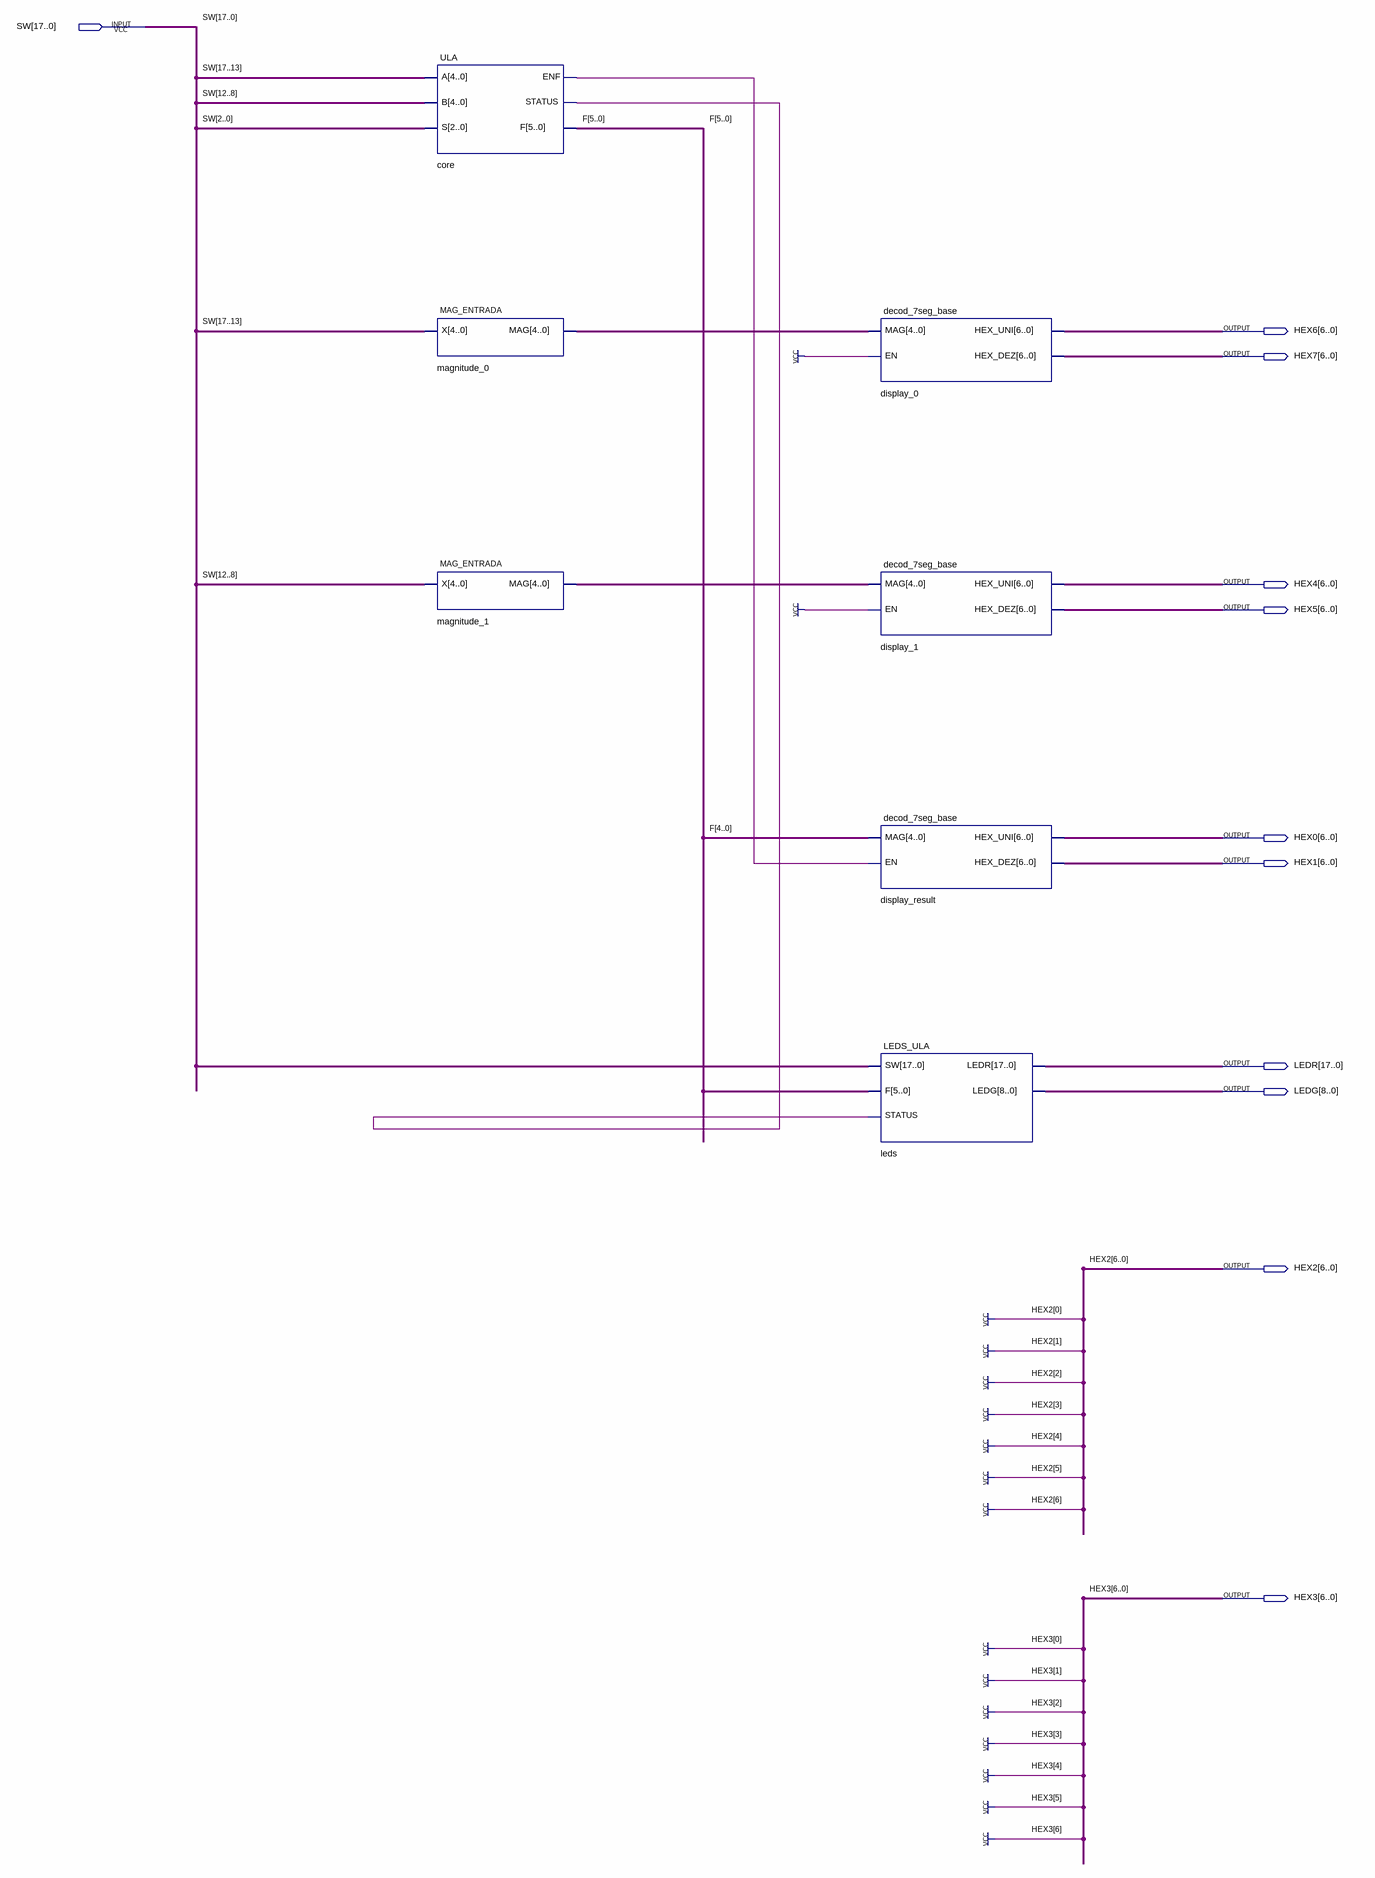
[diagram p0: schematic sheet]
// Quartus schematic TOP.bdf as structural Verilog: 7 symbols, 11 pins
module TOP (
  input  [17:0] SW,
  output [6:0] HEX6,
  output [6:0] HEX7,
  output [6:0] HEX4,
  output [6:0] HEX5,
  output [6:0] HEX0,
  output [6:0] HEX1,
  output [17:0] LEDR,
  output [8:0] LEDG,
  output [6:0] HEX2,
  output [6:0] HEX3
);

  wire core_enf, core_status;
  wire [4:0] magnitude_0_mag, magnitude_1_mag;
  wire [5:0] F;

  ULA core (.A(SW[17:13]), .B(SW[12:8]), .S(SW[2:0]), .ENF(core_enf), .STATUS(core_status), .F(F));
  MAG_ENTRADA magnitude_0 (.X(SW[17:13]), .MAG(magnitude_0_mag));
  MAG_ENTRADA magnitude_1 (.X(SW[12:8]), .MAG(magnitude_1_mag));
  decod_7seg_base display_0 (.MAG(magnitude_0_mag), .EN(1'b1), .HEX_UNI(HEX6), .HEX_DEZ(HEX7));
  decod_7seg_base display_1 (.MAG(magnitude_1_mag), .EN(1'b1), .HEX_UNI(HEX4), .HEX_DEZ(HEX5));
  decod_7seg_base display_result (.MAG(F[4:0]), .EN(core_enf), .HEX_UNI(HEX0), .HEX_DEZ(HEX1));
  LEDS_ULA leds (.SW(SW), .F(F), .STATUS(core_status), .LEDR(LEDR), .LEDG(LEDG));

  assign HEX2 = {7{1'b1}};
  assign HEX3 = {7{1'b1}};
endmodule
